# Altium schematic sheet [5]_HDMI.SchDoc
size A3; DocumentNumber: 5; SheetNumber: 5; SheetTotal: 9; PageSetup: Record=PageOptions|CenterHorizontal=True|CenterVertical=True|PrintScale=0.97|XCorrection=1.00|YCorrection=1.00|PrintKind=1|BorderSize=5000000|LeftOffset=0|BottomOffset=0|Orientation=2|PaperLength=2970|PaperWidth=2100|Scale=100|PaperSource=7|PrintQuality=600|MediaType=1|DitherType=10|PaperKind=A4|PrintScaleMode=1
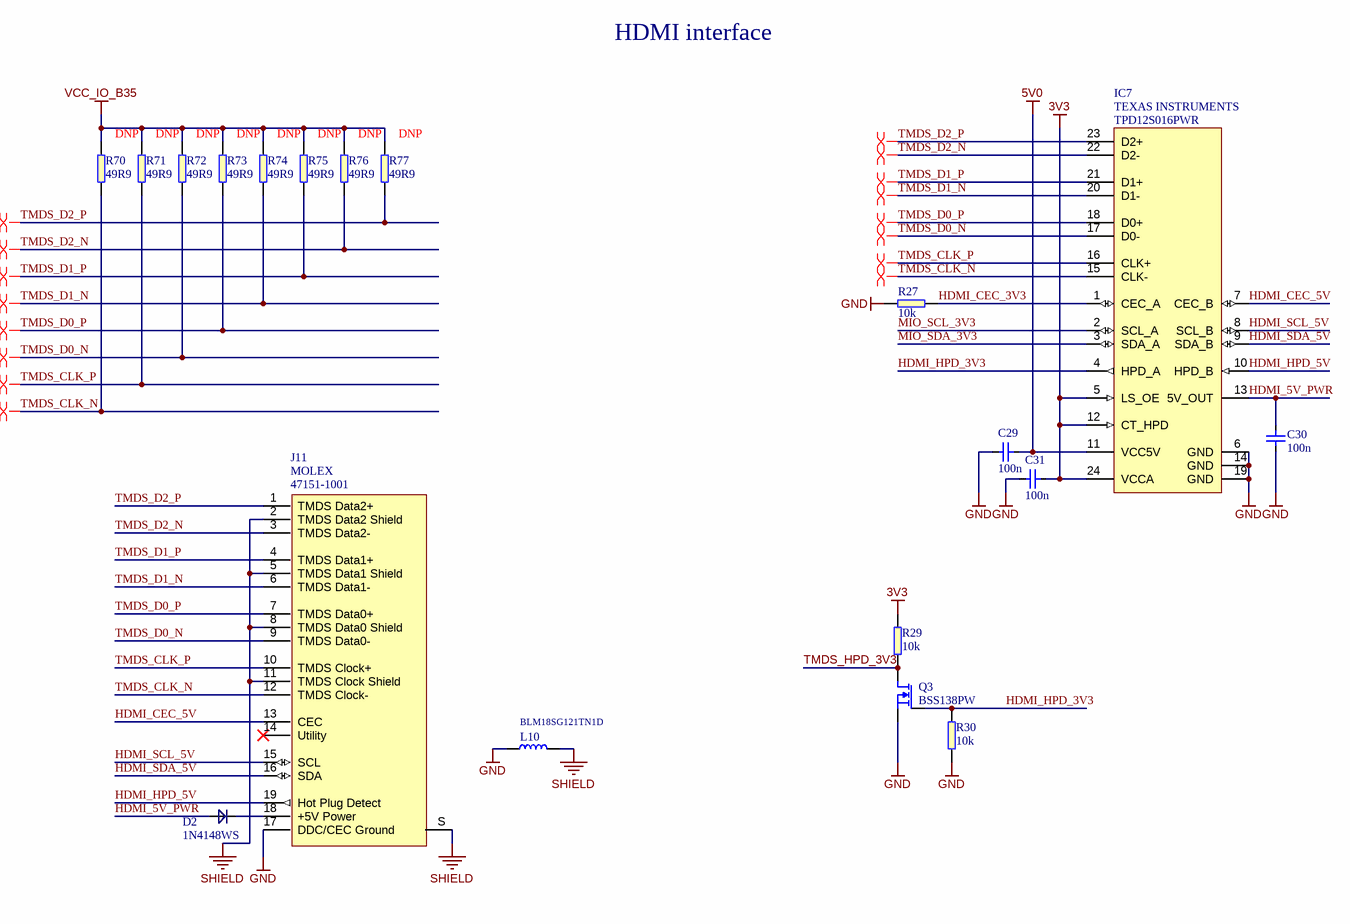
[diagram p0: [5]_HDMI.SchDoc]

## Parts
C29  100n  [0402]
C30  100n  [0402]
C31  100n  [0402]
D2  1N4148WS  [SOD-323]
IC7  TPD12S016PWR  Manufacturer: TEXAS INSTRUMENTS  [TSOP65P640X120-24L]
J11  47151-1001  Manufacturer: MOLEX  [Molex_HDMI_471511001]
L10  BLM18SG121TN1D  [0603]
Q3  BSS138PW  [SC70-3]
R27  10k  [0402]
R29  10k  [0402]
R30  10k  [0402]
R70  49R9  [0402]
R71  49R9  [0402]
R72  49R9  [0402]
R73  49R9  [0402]
R74  49R9  [0402]
R75  49R9  [0402]
R76  49R9  [0402]
R77  49R9  [0402]

## Nets
3V3: C31.1 IC7.5(LS_OE) IC7.12(CT_HPD) IC7.24(VCCA) R29.2
5V0: C29.1 IC7.11(VCC5V)
GND: C29.2 C30.2 C31.2 IC7.6(GND) IC7.14(GND) IC7.19(GND) J11.17(DDC/CEC_Ground) L10.1 Q3.2(S) R27.1 R30.1
SHIELD: J11.2(TMDS_Data2_Shield) J11.5(TMDS_Data1_Shield) J11.8(TMDS_Data0_Shield) J11.11(TMDS_Clock_Shield) J11.S(SH) L10.2
VCC_IO_B35: R70.2 R71.2 R72.2 R73.2 R74.2 R75.2 R76.2 R77.2
HDMI_5V_PWR: C30.1 D2.A IC7.13(5V_OUT)
HDMI_CEC_3V3: IC7.1(CEC_A) R27.2
HDMI_CEC_5V: IC7.7(CEC_B) J11.13(CEC)
HDMI_HPD_3V3: IC7.4(HPD_A) Q3.1(G) R30.2
HDMI_HPD_5V: IC7.10(HPD_B) J11.19(Hot_Plug_Detect)
HDMI_SCL_5V: IC7.8(SCL_B) J11.15(SCL)
HDMI_SDA_5V: IC7.9(SDA_B) J11.16(SDA)
MIO_SCL_3V3: IC7.2(SCL_A)
MIO_SDA_3V3: IC7.3(SDA_A)
TMDS_CLK_N: IC7.15(CLK-) J11.12(TMDS_Clock-) R70.1
TMDS_CLK_P: IC7.16(CLK+) J11.10(TMDS_Clock+) R71.1
TMDS_D0_N: IC7.17(D0-) J11.9(TMDS_Data0-) R72.1
TMDS_D0_P: IC7.18(D0+) J11.7(TMDS_Data0+) R73.1
TMDS_D1_N: IC7.20(D1-) J11.6(TMDS_Data1-) R74.1
TMDS_D1_P: IC7.21(D1+) J11.4(TMDS_Data1+) R75.1
TMDS_D2_N: IC7.22(D2-) J11.3(TMDS_Data2-) R76.1
TMDS_D2_P: IC7.23(D2+) J11.1(TMDS_Data2+) R77.1
TMDS_HPD_3V3: Q3.3(D) R29.1
NetD2_C: D2.C J11.18(+5V_Power)

Not connected (* = marked no-connect by the designer): J11 14(Utility)*

## Layout directives
differential pair: TMDS_CLK_N, TMDS_CLK_P, TMDS_D0_N, TMDS_D0_P, TMDS_D1_N, TMDS_D1_P, TMDS_D2_N, TMDS_D2_P

## Notes on the sheet
- HDMI interface
- DNP
- (near R77) DNP
- Title:
- Size:
- Date:
- A3
- Revision:
- Page:
- of
- Antmicro Ltd.
- File:
- www.antmicro.com

## Library data of the parts
C29-C31 = C_100n_0402: MLCC SMT Capacitor 100nF 0402; Manufacturer: MULTICOMP; Part Symbol: MC0402X104M100CT; Voltage: 10V; Tolerance: +-20%; Value: 100n; Part Number: C_100n_0402
D2 = 1N4148WS: Diode small signal; Manufacturer: ON SEMICONDUCTOR; Part Number: 1N4148WS; Value: 1N4148WS; Part Symbol: 1N4148WS
IC7 = TPD12S016PWR: TPD12S016PWR is a single-chip High Definition Multimedia Interface (HDMI); Part Number: TPD12S016PWR; Value: TPD12S016PWR; Part Symbol: TPD12S016PWR
J11 = CON-Molex-471511001: Header right angle HDMI; Part Number: CON-Molex-471511001; Value: 47151-1001; Part Symbol: 47151-1001
L10 = BLM18SG121TN1D: FERRITE BEAD, 0.025OHM, 3A, 0603; Manufacturer: MURATA; Part Number: BLM18SG121TN1D; Value: BLM18SG121TN1D; Part Symbol: BLM18SG121TN1D
Q3 = NMOS: MOSFET, N CH, 60V, 0.2A; Manufacturer: NXP; Value: BSS138PW; Part Number: BSS138PW; Part Symbol: BSS138PW
R27 R29 R30 = R_10k_0402: SMT Resistor 10k 0402; Manufacturer: MULTICOMP; Part Symbol: MCMR04X1002FTL; Tolerance: 1%; Part Number: R_10k_0402; Value: 10k
R70-R77 = R_49R9_0402: SMT Resistor 49R9 0402; Manufacturer: VISHAY; Part Symbol: CRCW040249R9FKED; Tolerance: 1%; Part Number: R_49R9_0402; Value: 49R9